# EAGLE design SmartHomeRelaisAktor_0.1 (EAGLE 9.6.2)
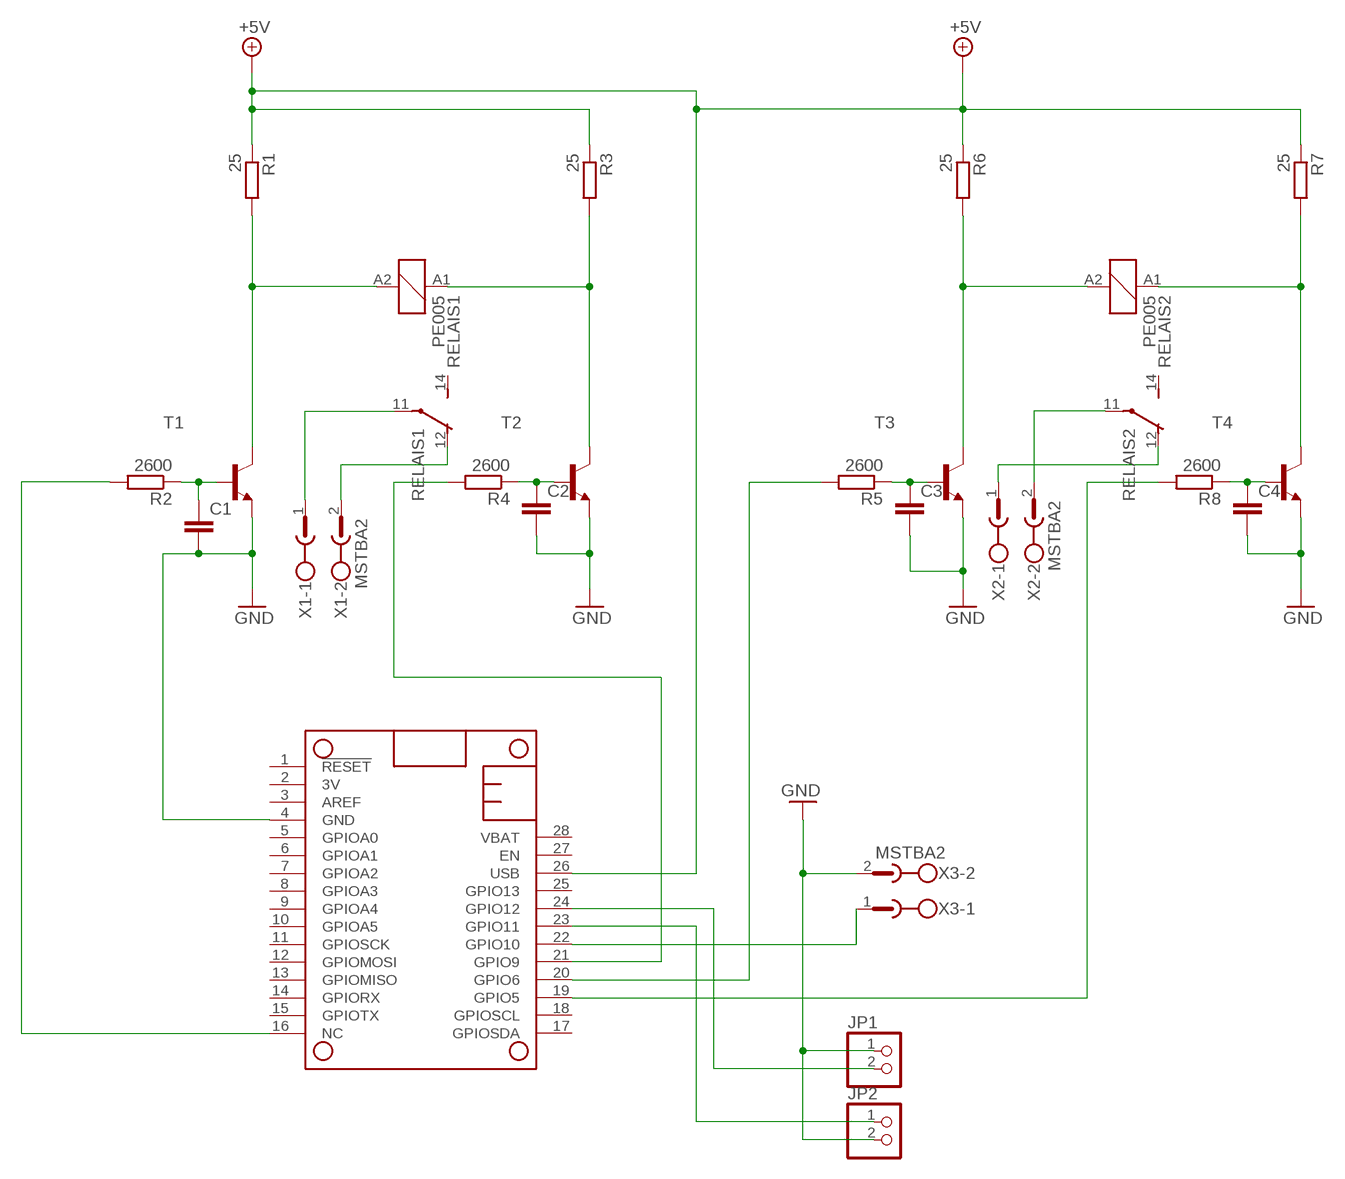
[diagram p0: schematic, sheet 1]

## Parts
C1  C-EUC0805  [C0805]
C2  C-EUC0805  [C0805]
C3  C-EUC0805  [C0805]
C4  C-EUC0805  [C0805]
JP1  PINHD-1X2  [1X02]
JP2  PINHD-1X2  [1X02]
MS1  FEATHERWING  [FEATHERWING]
R1  25  R-EU_R0805  [R0805]
R2  2600  R-EU_R0805  [R0805]
R3  25  R-EU_R0805  [R0805]
R4  2600  R-EU_R0805  [R0805]
R5  2600  R-EU_R0805  [R0805]
R6  25  R-EU_R0805  [R0805]
R7  25  R-EU_R0805  [R0805]
R8  2600  R-EU_R0805  [R0805]
RELAIS1  PE005  [PE]
RELAIS2  PE005  [PE]
T1  BC817-16-NPN-SOT23-BEC  [SOT23-BEC]
T2  BC817-16-NPN-SOT23-BEC  [SOT23-BEC]
T3  BC817-16-NPN-SOT23-BEC  [SOT23-BEC]
T4  BC817-16-NPN-SOT23-BEC  [SOT23-BEC]
X1  MSTBA2  [MSTBA2]
X2  MSTBA2  [MSTBA2]
X3  MSTBA2  [MSTBA2]

## Nets
GND: C1.2 C2.2 C3.2 C4.2 JP1.1 JP2.2 MS1.4(GND) T1.E T2.E T3.E T4.E X3.2
N$1: R1.2 RELAIS1.A2 T1.C
N$2: R3.2 RELAIS1.A1 T2.C
N$3: C2.1 R4.1 T2.B
N$4: C3.1 R5.1 T3.B
N$5: C1.1 R2.1 T1.B
N$6: R6.2 RELAIS2.A2 T3.C
N$7: R7.2 RELAIS2.A1 T4.C
N$8: C4.1 R8.1 T4.B
N$9: MS1.16(NC) R2.2
N$10: MS1.21(GPIO9) R4.2
N$11: MS1.20(GPIO6) R5.2
N$12: MS1.22(GPIO10) X3.1
N$13: RELAIS2.11(2:P) X2.2
N$14: RELAIS1.12(2:O) X1.2
N$15: RELAIS1.11(2:P) X1.1
N$16: MS1.19(GPIO5) R8.2
N$17: RELAIS2.12(2:O) X2.1
N$20: JP1.2 MS1.24(GPIO12)
N$21: JP2.1 MS1.23(GPIO11)
USB: MS1.26(USB) R1.1 R3.1 R6.1 R7.1 ; supply symbol labelled +5V
Unconnected: MS1.1(!RESET) MS1.2(3V) MS1.3(AREF) MS1.5(GPIOA0) MS1.6(GPIOA1) MS1.7(GPIOA2) MS1.8(GPIOA3) MS1.9(GPIOA4) MS1.10(GPIOA5) MS1.11(GPIOSCK) MS1.12(GPIOMOSI) MS1.13(GPIOMISO) MS1.14(GPIORX) MS1.15(GPIOTX) MS1.17(GPIOSDA) MS1.18(GPIOSCL) MS1.25(GPIO13) MS1.27(EN) MS1.28(VBAT) RELAIS1.14(2:S) RELAIS2.14(2:S)

## Library data of the parts
C1-C4 = rcl:C-EU: CAPACITOR, European symbol; SPICEPREFIX: C
JP1 JP2 = pinhead:PINHD-1X2: PIN HEADER
MS1 = adafruit:FEATHERWING
R1-R8 = rcl:R-EU_: RESISTOR, European symbol; SPICEPREFIX: R
RELAIS1 RELAIS2 = relay:PE*: Miniature PCB Relay 1 pole 5 A SCHRACK Source: http://www.schrack.com/.. 5807.pdf Miniature PCB Relay bistable 1pole 5 A, polarized bistable version Source: http://www.schrack.com/.. 5808.pdf; OC_FARNELL: unknown; OC_NEWARK: unknown
T1-T4 = transistor:*-NPN-: NPN Transistror BF959 corrected 2008.03.06
X1-X3 = con-phoenix-508:MSTBA2: PHOENIX; MF: FARNELL; MPN: 1757242; OC_FARNELL: 3705171; OC_NEWARK: 71C4161

## Board
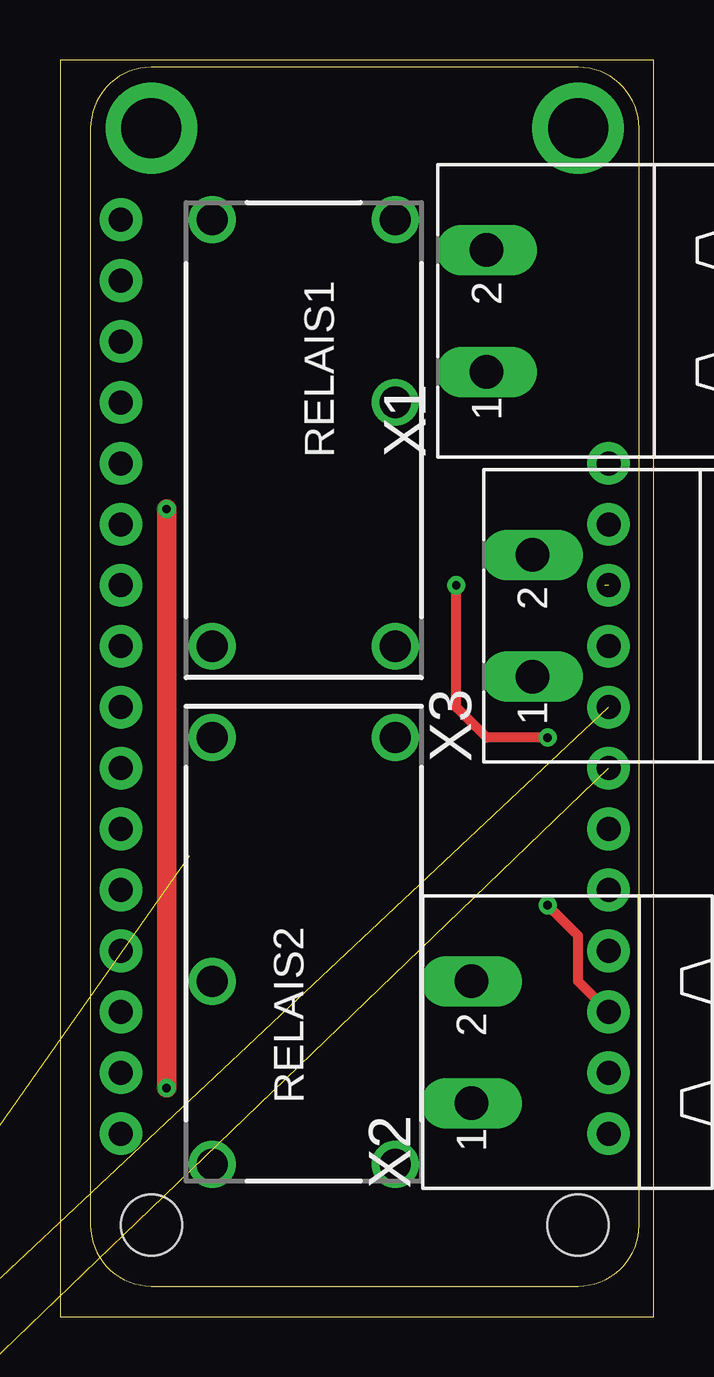
[diagram p1: board, top side]
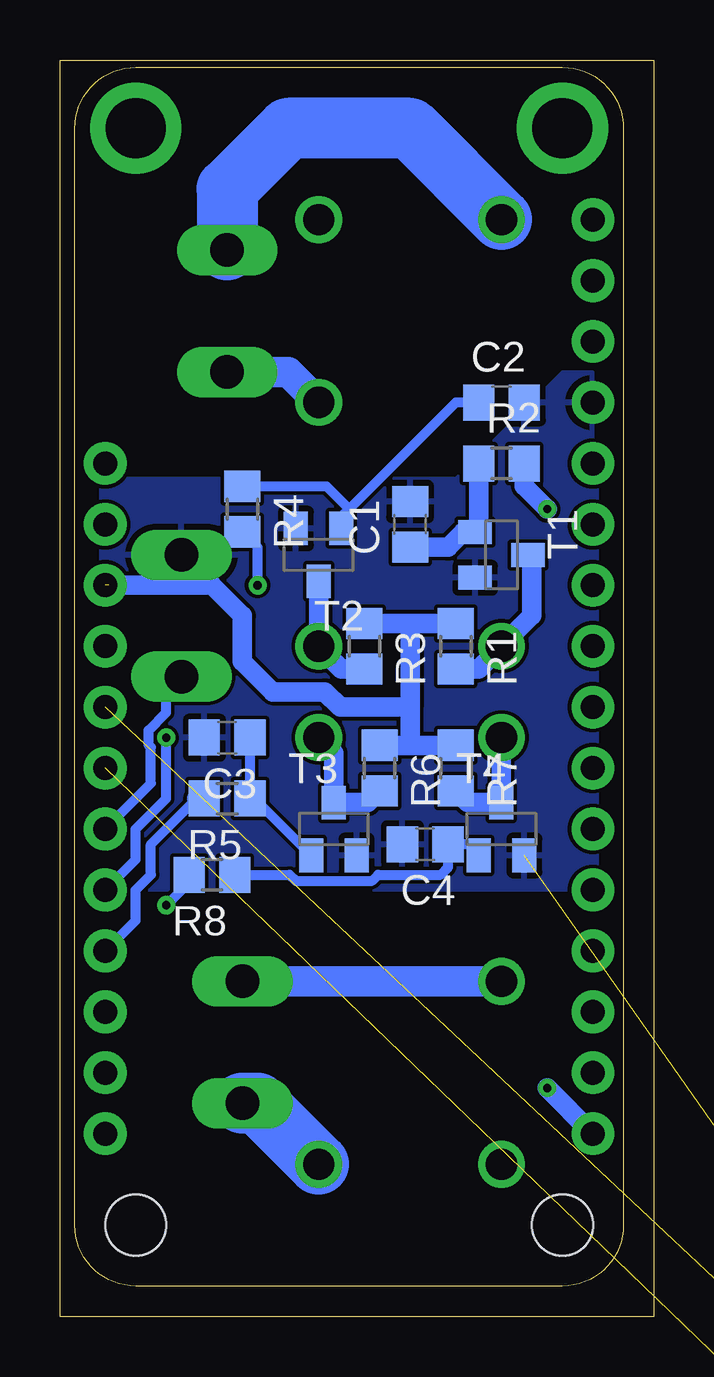
[diagram p2: board, bottom side, seen from below]

Size 24.75 x 52.38 mm. Coordinates in mm from the lower left corner, seen from the top.
Outline: 0,0 24.75,0 24.75,52.38 0,52.38 0,0
Copper layers (1*16): Top 0.035mm / dielectric 1.5mm / Bottom 0.035mm
Design rules "default": minimum track width 6mil, minimum drill 0.35mm, track to track 6mil, track to pad 6mil, pad to pad 6mil, via to via 6mil, smd to smd 6mil, copper to edge 40mil, drill to drill 6mil, minimum pad ring 10mil, minimum via ring 8mil, stop-mask expansion 4mil, vias tented up to drill 0mil, thermal gap 10mil

### Footprints (pad centres in the part's own frame; a part is rotated, then mirrored left to right if it is on the bottom)
C0805 = smd 1.3 x 1.5: 1 -0.95,0; 2 0.95,0
1X02 = drill 1.016 long: 1 -1.27,0; 2 1.27,0
FEATHERWING = drill 1 pad 1.778: 1 6.35,1.27; 2 8.89,1.27; 3 11.43,1.27; 4 13.97,1.27; 5 16.51,1.27; 6 19.05,1.27; 7 21.59,1.27; 8 24.13,1.27; 9 26.67,1.27; 10 29.21,1.27; 11 31.75,1.27; 12 34.29,1.27; 13 36.83,1.27; 14 39.37,1.27; 15 41.91,1.27; 16 44.45,1.27; 17 44.45,21.59; 18 41.91,21.59; 19 39.37,21.59; 20 36.83,21.59; 21 34.29,21.59; 22 31.75,21.59; 23 29.21,21.59; 24 26.67,21.59; 25 24.13,21.59; 26 21.59,21.59; 27 19.05,21.59; 28 16.51,21.59 | drill 2.5 pad 3.81: P$1 2.54,20.32; P$2 2.54,2.54 | hole 2.54: 48.26,20.32; 48.26,2.54
R0805 = smd 1.3 x 1.5: 1 -0.95,0; 2 0.95,0
PE = drill 1.3: 11 -1.27,3.81; 12 -8.89,-3.81; 14 -8.89,3.81; A1 8.89,3.81; A2 8.89,-3.81
SOT23-BEC = smd 1 x 1.4: B -0.95,-1.1; C 0,1.1; E 0.95,-1.1
MSTBA2 = drill 1.397 long: 1 -2.54,5.08; 2 2.54,5.08

### Placement (x,y rotation side)
C1  10.16,33.02 90 bottom
C2  6.35,38.1 0 bottom
C3  17.78,24.13 180 bottom
C4  9.53,19.68 180 bottom
JP1  -9.53,-3.81 0 top  (outside the outline)
JP2  -9.53,-9.53 0 top  (outside the outline)
MS1  1.27,52.07 270 top
R1  8.26,27.94 270 bottom
R2  6.35,35.56 0 bottom
R3  12.06,27.94 270 bottom
R4  17.14,33.66 270 bottom
R5  17.78,21.59 180 bottom
R6  11.43,22.86 270 bottom
R7  8.26,22.86 270 bottom
R8  18.41,18.41 180 bottom
RELAIS1  10.16,36.83 270 top
RELAIS2  10.16,15.24 90 top
T1  6.35,31.75 270 bottom
T2  13.97,31.75 180 bottom
T3  13.34,20.32 0 bottom
T4  6.35,20.32 0 bottom
X1  22.86,41.91 90 top
X2  22.23,11.43 90 top
X3  24.77,29.21 90 top

### Tracks (layer width: path | path; a pad name or v marks a point on that pad's centre or on a via)
GND  (2 unrouted)
  pour Bottom: 24.13,34.92 1.27,34.92 1.27,17.78 24.13,17.78
  pour Bottom: 2.54,39.37 3.81,39.37 8.26,34.92 20.95,34.92 20.95,31.75 2.54,31.75
N$1
  Bottom 0.813: R1.2 7.3,26.99 RELAIS1.A2 5.08,29.21 5.08,31.58 T1.C
N$2
  Bottom 0.813: R3.2 13.02,26.99 RELAIS1.A1 T2.C
N$3
  Bottom 0.406: C2.1 8.26,38.1 12.7,33.66 | 12.7,33.66 13.02,33.34 T2.B | R4.1 13.65,34.6 12.7,33.66
N$4
  Bottom 0.406: T3.B 16.66,21.59 | C3.1 R5.1
  Bottom 0.813: R5.1 16.66,21.59
N$5
  Bottom 0.813: R2.1 7.3,32.85 T1.B 7.94,32.7 8.57,32.07 C1.1
N$6
  Bottom 0.813: R6.2 11.92,21.42 T3.C 13.34,23.5 RELAIS2.A2
N$7
  Bottom 0.813: RELAIS2.A1 T4.C 7.76,21.42 R7.2
N$8
  Bottom 0.406: T4.B 7.76,19.68 C4.1 8.57,18.73 8.89,18.41 11.49,18.41 11.74,18.16 14.93,18.16 15.18,18.41 R8.1
N$9  (via drill 0.35)
  Top 0.813: v4.45,9.53 v4.45,33.66
  Bottom 0.813: MS1.16 v4.45,9.53 | v4.45,33.66 5.4,34.61 R2.2
N$10  (via drill 0.35)
  Top 0.406: v20.32,24.13 17.78,24.13 16.51,25.4 v16.51,30.48
  Bottom 0.406: MS1.21 21.59,19.05 21.59,20.32 20.32,21.59 v20.32,24.13 | v16.51,30.48 16.51,32.07 R4.2
N$11
  Bottom 0.406: MS1.20 21.59,16.51 21.59,17.78 20.95,18.41 20.95,19.68 19.05,21.59
  Bottom 0.813: 19.05,21.59 R5.2
N$12
  Bottom 0.406: MS1.22 20.95,22.23 20.95,23.73 21.05,23.83 21.05,24.43 20.32,25.17 20.32,26.04 X3.1
N$13
  Bottom 1.27: RELAIS2.11 X2.2
N$14
  Bottom 2.54: RELAIS1.12 10.16,49.53 15.24,49.53 17.78,46.99 X1.2
N$15
  Bottom 1.27: RELAIS1.11 15.24,39.37 X1.1
N$16  (via drill 0.35)
  Top 0.406: MS1.19 21.59,13.97 21.59,15.88 v20.32,17.14
  Bottom 0.406: v20.32,17.14 19.36,18.1 R8.2
N$17
  Bottom 2.54: RELAIS2.12 16.51,8.89 X2.1
N$20  (1 unrouted)
N$21  (1 unrouted)
USB  (1 unrouted)
  Bottom 0.813: R7.1 10.16,23.81 | 10.16,23.81 R6.1 | R1.1 10.16,28.89 | 10.16,28.89 R3.1 | 10.16,28.89 10.16,25.4 | 22.71,30.48 18.41,30.48 17.14,29.21 17.14,27.3 15.88,26.04 13.71,26.04 13.07,25.4 10.16,25.4 | 10.16,23.81 10.16,25.4